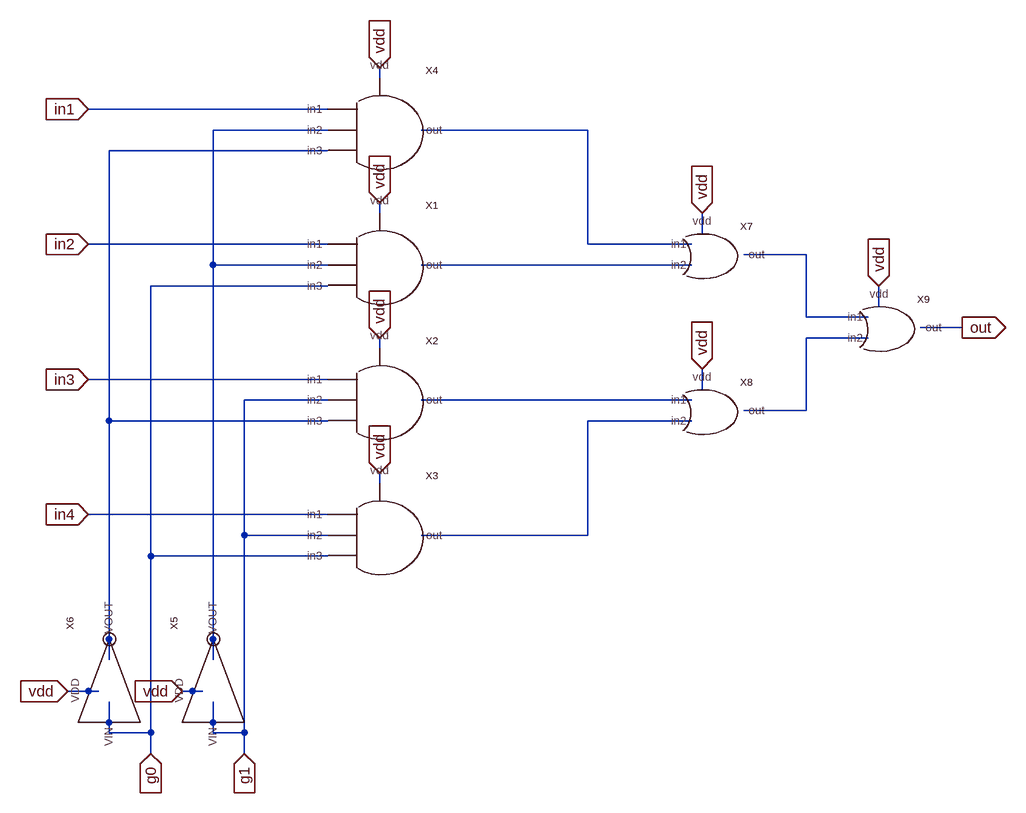
[diagram p0: schematic mux4.asc]
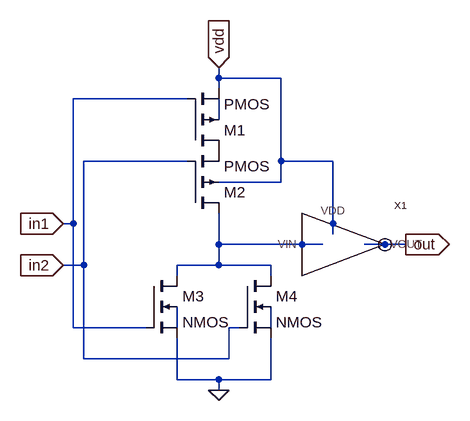
[diagram p1: sub-circuit or.asc]
mux4.asc, the LTspice schematic file:
Version 4
SHEET 1 1428 876
WIRE 432 -256 432 -272
WIRE 352 -208 -16 -208
WIRE 352 -176 176 -176
WIRE 752 -176 496 -176
WIRE 352 -144 16 -144
WIRE 432 -48 432 -64
WIRE 928 -16 928 -48
WIRE 352 0 -16 0
WIRE 752 0 752 -176
WIRE 912 0 752 0
WIRE 1088 16 992 16
WIRE 176 32 176 -176
WIRE 352 32 176 32
WIRE 912 32 496 32
WIRE 352 64 80 64
WIRE 1200 96 1200 64
WIRE 1088 112 1088 16
WIRE 1184 112 1088 112
WIRE 1328 128 1264 128
WIRE 1184 144 1088 144
WIRE 432 160 432 144
WIRE 352 208 -16 208
WIRE 928 224 928 192
WIRE 352 240 224 240
WIRE 912 240 496 240
WIRE 1088 256 1088 144
WIRE 1088 256 992 256
WIRE 16 272 16 -144
WIRE 352 272 16 272
WIRE 912 272 752 272
WIRE 432 368 432 352
WIRE 352 416 -16 416
WIRE 224 448 224 240
WIRE 352 448 224 448
WIRE 752 448 752 272
WIRE 752 448 496 448
WIRE 80 480 80 64
WIRE 352 480 80 480
WIRE 16 640 16 272
WIRE 176 640 176 32
WIRE 0 688 -48 688
WIRE 160 688 128 688
WIRE 16 752 16 704
WIRE 80 752 80 480
WIRE 80 752 16 752
WIRE 176 752 176 704
WIRE 224 752 224 448
WIRE 224 752 176 752
WIRE 80 784 80 752
WIRE 224 784 224 752
FLAG -16 -208 in1
IOPIN -16 -208 In
FLAG -16 0 in2
IOPIN -16 0 In
FLAG -16 208 in3
IOPIN -16 208 In
FLAG -16 416 in4
IOPIN -16 416 In
FLAG 80 784 g0
IOPIN 80 784 In
FLAG 224 784 g1
IOPIN 224 784 In
FLAG -48 688 vdd
IOPIN -48 688 In
FLAG 128 688 vdd
IOPIN 128 688 In
FLAG 432 352 vdd
IOPIN 432 352 In
FLAG 432 144 vdd
IOPIN 432 144 In
FLAG 432 -64 vdd
IOPIN 432 -64 In
FLAG 432 -272 vdd
IOPIN 432 -272 In
FLAG 928 192 vdd
IOPIN 928 192 In
FLAG 928 -48 vdd
IOPIN 928 -48 In
FLAG 1200 64 vdd
IOPIN 1200 64 In
FLAG 1328 128 out
IOPIN 1328 128 Out
SYMBOL and3 432 32 R0
SYMATTR InstName X1
SYMBOL and3 432 240 R0
SYMATTR InstName X2
SYMBOL and3 432 -176 R0
SYMATTR InstName X4
SYMBOL inverter 176 688 R270
SYMATTR InstName X5
SYMBOL inverter 16 688 R270
SYMATTR InstName X6
SYMBOL and3 432 448 R0
SYMATTR InstName X3
SYMBOL or 928 16 R0
SYMATTR InstName X7
SYMBOL or 928 256 R0
SYMATTR InstName X8
SYMBOL or 1200 128 R0
SYMATTR InstName X9

or.asc, the sub-circuit schematic file:
Version 4
SHEET 1 880 680
WIRE 288 -128 288 -144
WIRE 384 -128 288 -128
WIRE 288 -112 288 -128
WIRE 240 -96 64 -96
WIRE 288 -64 288 -96
WIRE 240 0 80 0
WIRE 384 0 384 -128
WIRE 464 0 384 0
WIRE 384 32 384 0
WIRE 384 32 288 32
WIRE 64 96 64 -96
WIRE 64 96 48 96
WIRE 464 112 464 0
WIRE 288 128 288 80
WIRE 448 128 288 128
WIRE 576 128 512 128
WIRE 80 160 80 0
WIRE 80 160 48 160
WIRE 288 160 288 128
WIRE 288 160 224 160
WIRE 368 160 288 160
WIRE 224 176 224 160
WIRE 368 176 368 160
WIRE 64 256 64 96
WIRE 176 256 64 256
WIRE 224 256 224 224
WIRE 320 256 304 256
WIRE 368 256 368 224
WIRE 80 304 80 160
WIRE 304 304 304 256
WIRE 304 304 80 304
WIRE 224 336 224 272
WIRE 288 336 224 336
WIRE 368 336 368 272
WIRE 368 336 288 336
WIRE 288 352 288 336
FLAG 48 96 in1
IOPIN 48 96 In
FLAG 48 160 in2
IOPIN 48 160 In
FLAG 576 128 out
IOPIN 576 128 Out
FLAG 288 -144 vdd
IOPIN 288 -144 In
FLAG 288 352 0
SYMBOL pmos4 240 -16 M180
SYMATTR InstName M1
SYMATTR Value2 l=90n w=400n
SYMBOL pmos4 240 80 M180
SYMATTR InstName M2
SYMATTR Value2 l=90n w=400n
SYMBOL nmos4 176 176 R0
SYMATTR InstName M3
SYMATTR Value2 l=90n w=200n
SYMBOL nmos4 320 176 R0
SYMATTR InstName M4
SYMATTR Value2 l=90n w=200n
SYMBOL inverter 464 128 R0
SYMATTR InstName X1

The netlist it stands for:
* mux4.asc
XX1 in2 N001 g0 N005 vdd and3  ; pins in1 in2 in3 out vdd
XX2 in3 g1 N003 N007 vdd and3  ; pins in1 in2 in3 out vdd
XX4 in1 N001 N003 N002 vdd and3  ; pins in1 in2 in3 out vdd
XX5 vdd N001 g1 inverter  ; pins VDD VOUT VIN
XX6 vdd N003 g0 inverter  ; pins VDD VOUT VIN
XX3 in4 g1 g0 N008 vdd and3  ; pins in1 in2 in3 out vdd
XX7 N002 N005 vdd N004 or
XX8 N007 N008 vdd N006 or
XX9 N004 N006 vdd out or

* block symbol definitions
.subckt or in1 in2 vdd out
M1 P001 in1 vdd N001 PMOS l=90n w=400n
M2 N002 in2 P001 vdd PMOS l=90n w=400n
M3 N002 in1 0 N003 NMOS l=90n w=200n
M4 N002 in2 0 N004 NMOS l=90n w=200n
XX1 vdd out N002 inverter  ; pins VDD VOUT VIN
.ends or

.model NMOS NMOS
.model PMOS PMOS
.lib standard.mos
.backanno
.end